# EAGLE design USB2myBus (EAGLE 7.3.0)
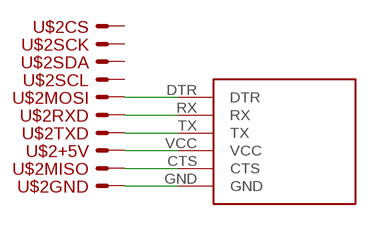
[diagram p0: schematic, sheet 1]

## Parts
U$1  USB2SERIAL  [USB2SERIAL]
U$2  SPI_BUS  [SPI_BUS]

## Nets
N$1: U$1.RX U$2.RXD
N$2: U$1.VCC U$2.+5V
N$3: U$1.TX U$2.TXD
N$4: U$1.GND U$2.GND
N$5: U$1.CTS U$2.MISO
N$6: U$1.DTR U$2.MOSI
Unconnected: U$2.CS U$2.SCK U$2.SCL U$2.SDA

## Library data of the parts
U$1 = lieven:USB2SERIAL
U$2 = lieven:SPI_BUS

## Board
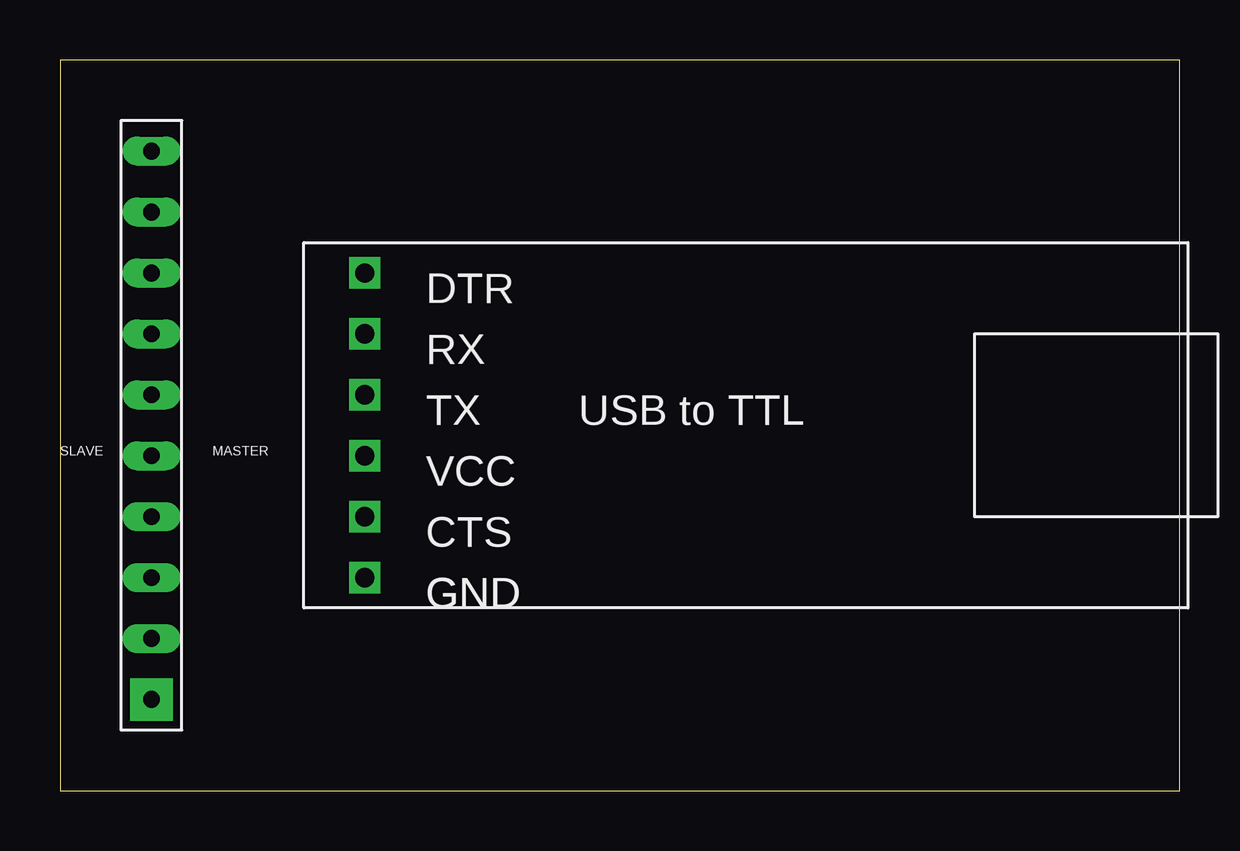
[diagram p1: board, top side]
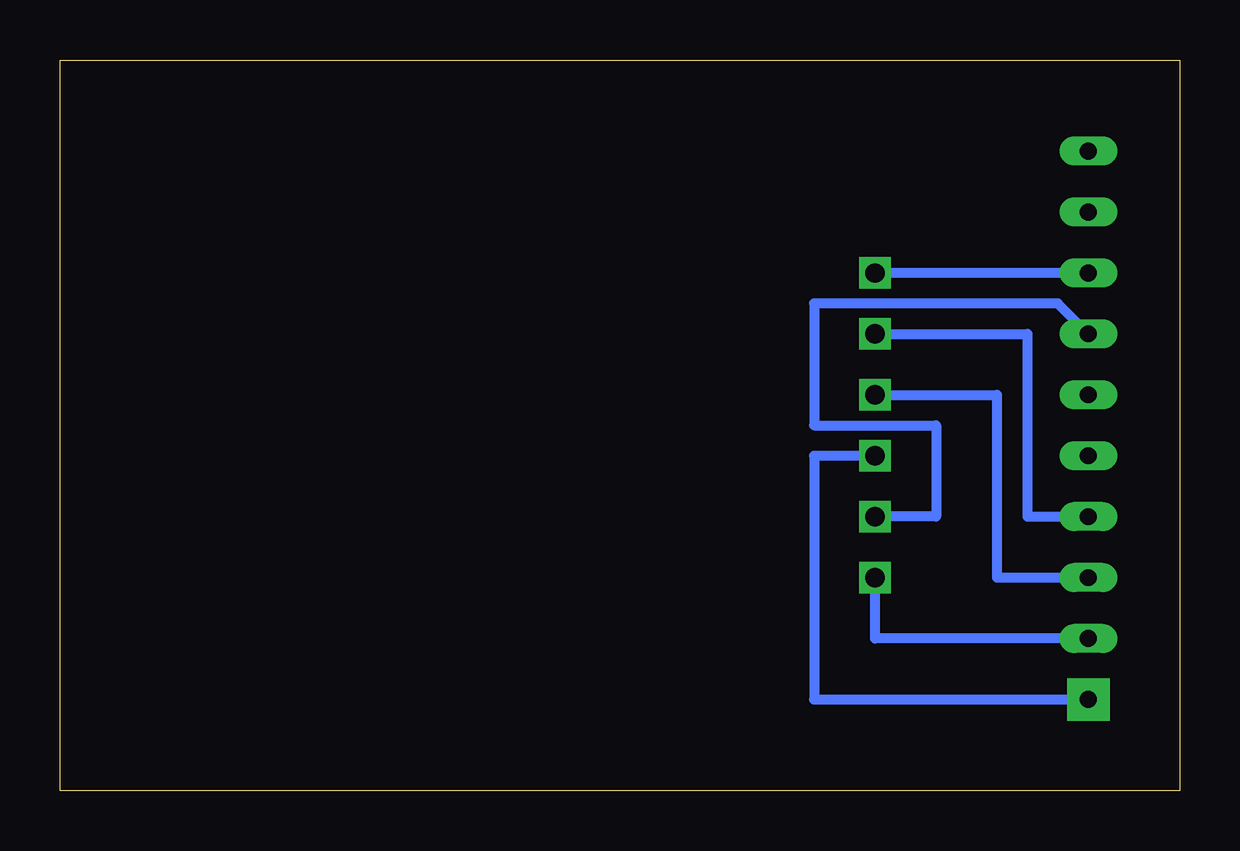
[diagram p2: board, bottom side, seen from below]

Size 46.66 x 30.47 mm. Coordinates in mm from the lower left corner, seen from the top.
Outline: 0,0 46.66,0 46.66,30.47 0,30.47 0,0
Copper layers (1*16): Top 0.035mm / dielectric 1.5mm / Bottom 0.035mm
Design rules "default": minimum track width 10mil, minimum drill 24mil, track to track 8mil, track to pad 8mil, pad to pad 8mil, via to via 8mil, smd to smd 8mil, copper to edge 40mil, drill to drill 8mil, minimum pad ring 10mil, minimum via ring 8mil, stop-mask expansion 4mil, vias tented up to drill 0mil, thermal gap 10mil

### Footprints (pad centres in the part's own frame; a part is rotated, then mirrored left to right if it is on the bottom)
USB2SERIAL = drill 0.8 square: CTS 2.54,3.81; DTR 2.54,13.97; GND 2.54,1.27; RX 2.54,11.43; TX 2.54,8.89; VCC 2.54,6.35
SPI_BUS = drill 0.7 pad 1.778 square: +5V 0,0 | drill 0.7 long: CS 0,22.86; GND 0,2.54; MISO 0,15.24; MOSI 0,17.78; RXD 0,7.62; SCK 0,20.32; SCL 0,10.16; SDA 0,12.7; TXD 0,5.08

### Placement (x,y rotation side)
U$1  10.16,7.62 0 top
U$2  3.81,3.81 0 top

### Tracks (layer width: path | path; a pad name or v marks a point on that pad's centre or on a via)
N$1
  Bottom 0.406: U$1.RX 6.35,19.05 6.35,11.43 U$2.RXD
N$2
  Bottom 0.406: U$1.VCC 15.24,13.97 15.24,3.81 U$2.+5V
N$3
  Bottom 0.406: U$1.TX 7.62,16.51 7.62,8.89 U$2.TXD
N$4
  Bottom 0.406: U$2.GND 12.7,6.35 U$1.GND
N$5
  Bottom 0.406: U$2.MISO 5.08,20.32 15.24,20.32 15.24,15.24 10.16,15.24 10.16,11.43 U$1.CTS
N$6
  Bottom 0.406: U$2.MOSI U$1.DTR